# Altium schematic sheet multiSheet2.SchDoc
size A4; SheetNumber: 2; SheetTotal: 2
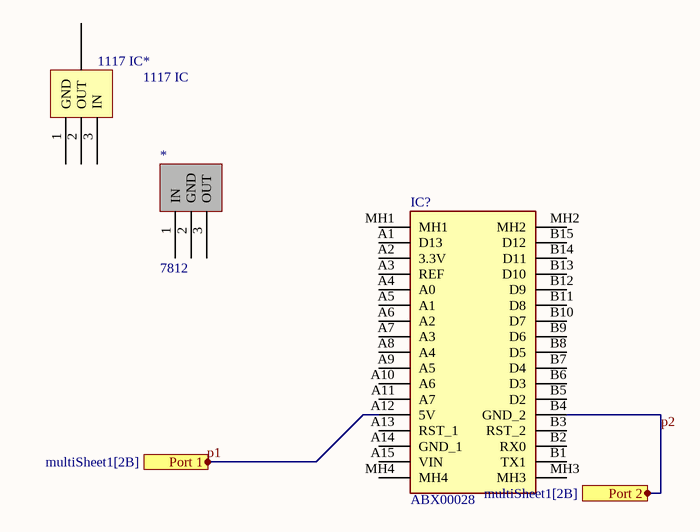
[diagram p0: multiSheet2.SchDoc]

## Parts
(Parts that share a designator on the sheet are numbered #1, #2 ... from top to bottom, then left to right.)
*#1  1117 IC  [1117 ic]
*#2  7812  [7812]
IC?  ABX00028  [ABX00028]

## Ports
Port 1 (see multiSheet1[2B]), Port 2 (see multiSheet1[2B])

## Nets
p1: IC?.A12(5V) ; port Port 1
p2: IC?.B4(GND_2) ; port Port 2

Not connected (* = marked no-connect by the designer): *#1 1(GND) 2(OUT) 3(IN) ?1; *#2 1(IN) 2(GND) 3(OUT); IC? A1(D13) A2(3.3V) A3(REF) A4(A0) A5(A1) A6(A2) A7(A3) A8(A4) A9(A5) A10(A6) A11(A7) A13(RST_1) A14(GND_1) A15(VIN) B1(TX1) B2(RX0) B3(RST_2) B5(D2) B6(D3) B7(D4) B8(D5) B9(D6) B10(D7) B11(D8) B12(D9) B13(D10) B14(D11) B15(D12) MH1 MH2 MH3 MH4

## Library data of the parts
IC? = ABX00028: Integrated Circuit; Manufacturer_Name: Arduino; Datasheet Link: https://store.arduino.cc/arduino-nano-every; Height: 10mm; Manufacturer_Part_Number: ABX00028; Mouser Part Number: 782-ABX00028; Mouser Price/Stock: https://www.mouser.co.uk/ProductDetail/Arduino/ABX00028?qs=PzGy0jfpSMtit6rnFl8mVg%3D%3D; Arrow Part Number: ABX00028; Arrow Price/Stock: https://www.arrow.com/en/products/abx00028/arduino-corporation?region=nac